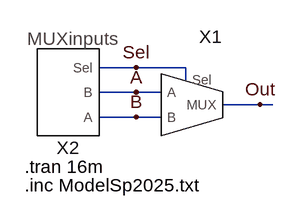
[diagram p0: schematic MUXtest.asc]
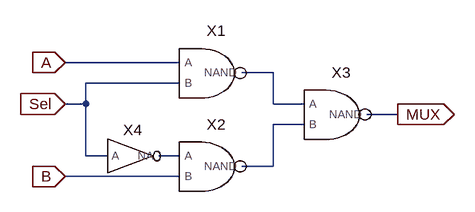
[diagram p1: sub-circuit mux.asc]
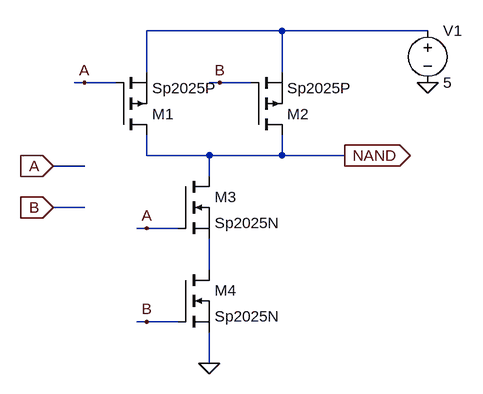
[diagram p2: sub-circuit nand.asc]
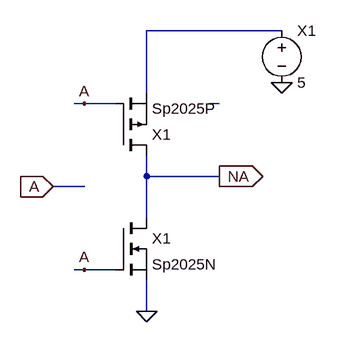
[diagram p3: sub-circuit invert.asc]
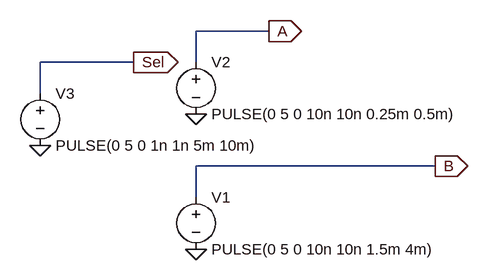
[diagram p4: sub-circuit muxinputs.asc]
MUXtest.asc, the LTspice schematic file:
Version 4.1.1
SHEET 1 1928 680
WIRE 208 128 160 128
WIRE 272 128 208 128
WIRE 272 144 272 128
WIRE 208 160 160 160
WIRE 240 160 208 160
WIRE 368 176 320 176
WIRE 384 176 368 176
WIRE 208 192 160 192
WIRE 240 192 208 192
FLAG 368 176 Out
FLAG 208 128 Sel
FLAG 208 160 A
FLAG 208 192 B
SYMBOL MUX 304 160 R0
SYMATTR InstName X1
SYMBOL MUXinputs 112 160 M180
SYMATTR InstName X2
TEXT 64 256 Left 2 !.tran 16m
TEXT 64 280 Left 2 !.inc ModelSp2025.txt

mux.asc, the sub-circuit schematic file:
Version 4.1
SHEET 1 880 680
WIRE 96 80 -80 80
WIRE 240 96 192 96
WIRE 96 112 -48 112
WIRE -48 144 -48 112
WIRE -48 144 -80 144
WIRE 240 144 240 96
WIRE 288 144 240 144
WIRE 432 160 384 160
WIRE 288 176 240 176
WIRE -48 224 -48 144
WIRE -16 224 -48 224
WIRE 96 224 64 224
WIRE 240 240 240 176
WIRE 240 240 192 240
WIRE 96 256 -80 256
FLAG 432 160 MUX
IOPIN 432 160 Out
FLAG -80 80 A
IOPIN -80 80 In
FLAG -80 256 B
IOPIN -80 256 In
FLAG -80 144 Sel
IOPIN -80 144 In
SYMBOL NAND 144 96 R0
SYMATTR InstName X1
SYMBOL NAND 144 240 R0
SYMATTR InstName X2
SYMBOL NAND 336 160 R0
SYMATTR InstName X3
SYMBOL INVERT 16 224 R0
SYMATTR InstName X4

nand.asc, the sub-circuit schematic file:
Version 4.1.1
SHEET 1 880 680
WIRE 336 -160 128 -160
WIRE 560 -160 336 -160
WIRE 128 -96 128 -160
WIRE 336 -96 336 -160
WIRE 32 -80 16 -80
WIRE 80 -80 32 -80
WIRE 240 -80 224 -80
WIRE 288 -80 240 -80
WIRE 128 32 128 0
WIRE 224 32 128 32
WIRE 336 32 336 0
WIRE 336 32 224 32
WIRE 432 32 336 32
WIRE 32 48 -16 48
WIRE 224 64 224 32
WIRE 32 112 -16 112
WIRE 128 144 112 144
WIRE 176 144 128 144
WIRE 224 208 224 160
WIRE 128 288 112 288
WIRE 176 288 128 288
WIRE 224 352 224 304
FLAG 224 352 0
FLAG -16 48 A
IOPIN -16 48 In
FLAG -16 112 B
IOPIN -16 112 In
FLAG 128 144 A
FLAG 128 288 B
FLAG 32 -80 A
FLAG 240 -80 B
FLAG 432 32 NAND
IOPIN 432 32 Out
FLAG 560 -80 0
SYMBOL pmos 80 0 M180
SYMATTR InstName M1
SYMATTR Value Sp2025P
SYMBOL pmos 288 0 M180
SYMATTR InstName M2
SYMATTR Value Sp2025P
SYMBOL nmos 176 64 R0
SYMATTR InstName M3
SYMATTR Value Sp2025N
SYMBOL nmos 176 208 R0
SYMATTR InstName M4
SYMATTR Value Sp2025N
SYMBOL voltage 560 -176 R0
SYMATTR InstName V1
SYMATTR Value 5

invert.asc, the sub-circuit schematic file:
Version 4
SHEET 1 880 680
WIRE 352 -80 144 -80
WIRE 144 16 144 -80
WIRE 48 32 32 32
WIRE 96 32 48 32
WIRE 256 32 240 32
WIRE 144 144 144 112
WIRE 256 144 144 144
WIRE 48 160 0 160
WIRE 144 208 144 144
WIRE 48 288 32 288
WIRE 96 288 48 288
WIRE 144 352 144 304
FLAG 144 352 0
FLAG 0 160 A
IOPIN 0 160 In
FLAG 48 288 A
FLAG 48 32 A
FLAG 256 144 NA
IOPIN 256 144 Out
FLAG 352 0 0
SYMBOL pmos 96 112 M180
SYMATTR InstName X1
SYMATTR Value Sp2025P
SYMBOL nmos 96 208 R0
SYMATTR InstName X1
SYMATTR Value Sp2025N
SYMBOL voltage 352 -96 R0
SYMATTR InstName X1
SYMATTR Value 5

muxinputs.asc, the sub-circuit schematic file:
Version 4
SHEET 1 880 680
WIRE 304 -48 192 -48
WIRE 96 0 -48 0
WIRE 192 0 192 -48
WIRE -48 48 -48 0
WIRE 560 160 192 160
WIRE 192 208 192 160
FLAG -48 128 0
FLAG 192 80 0
FLAG 192 288 0
FLAG 96 0 Sel
IOPIN 96 0 Out
FLAG 304 -48 A
IOPIN 304 -48 Out
FLAG 560 160 B
IOPIN 560 160 Out
SYMBOL voltage 192 192 R0
WINDOW 123 0 0 Left 0
WINDOW 39 0 0 Left 0
SYMATTR InstName V1
SYMATTR Value PULSE(0 5 0 10n 10n 1.5m 4m)
SYMBOL voltage 192 -16 R0
WINDOW 123 0 0 Left 0
WINDOW 39 0 0 Left 0
SYMATTR InstName V2
SYMATTR Value PULSE(0 5 0 10n 10n 0.25m 0.5m)
SYMBOL voltage -48 32 R0
WINDOW 123 0 0 Left 0
WINDOW 39 0 0 Left 0
SYMATTR InstName V3
SYMATTR Value PULSE(0 5 0 1n 1n 5m 10m)

The netlist it stands for:
* MUXtest.asc
XX1 A B Sel Out mux
XX2 B A Sel muxinputs

* block symbol definitions
.subckt mux A B Sel MUX
X§X1 A Sel N001 nand
X§X2 N003 B N002 nand
X§X3 N001 N002 MUX nand
X§X4 Sel N003 invert
.ends mux

.subckt nand A B NAND
M1 NAND A N001 N001 Sp2025P
M2 NAND B N001 N001 Sp2025P
M3 NAND A N002 N002 Sp2025N
M4 N002 B 0 0 Sp2025N
V1 N001 0 5
.ends nand

.subckt invert A NA
M§X1 NA A N001 N001 Sp2025P
M§X1 NA A 0 0 Sp2025N
V§X1 N001 0 5
.ends invert

.subckt muxinputs A B Sel
V1 B 0 PULSE(0 5 0 10n 10n 1.5m 4m)
V2 A 0 PULSE(0 5 0 10n 10n 0.25m 0.5m)
V3 Sel 0 PULSE(0 5 0 1n 1n 5m 10m)
.ends muxinputs

.model NMOS NMOS
.model PMOS PMOS
.lib standard.mos
.tran 16m
.inc ModelSp2025.txt
.backanno
.end